# EasyEDA Pro project 四轴机械臂主控板.eprj

# Schematic Schematic1_6
Create Date: 2023-11-30; Page Name: 海豚机械臂主控板; Project Name: 海豚机械臂主控板; Schematic Name: Schematic1_6; Update Date: 2023-11-30; Company: 启能团队; Drawed: 郭俊杰; Page Size: A4; Reviewed: 郭俊杰; Version: V1.0
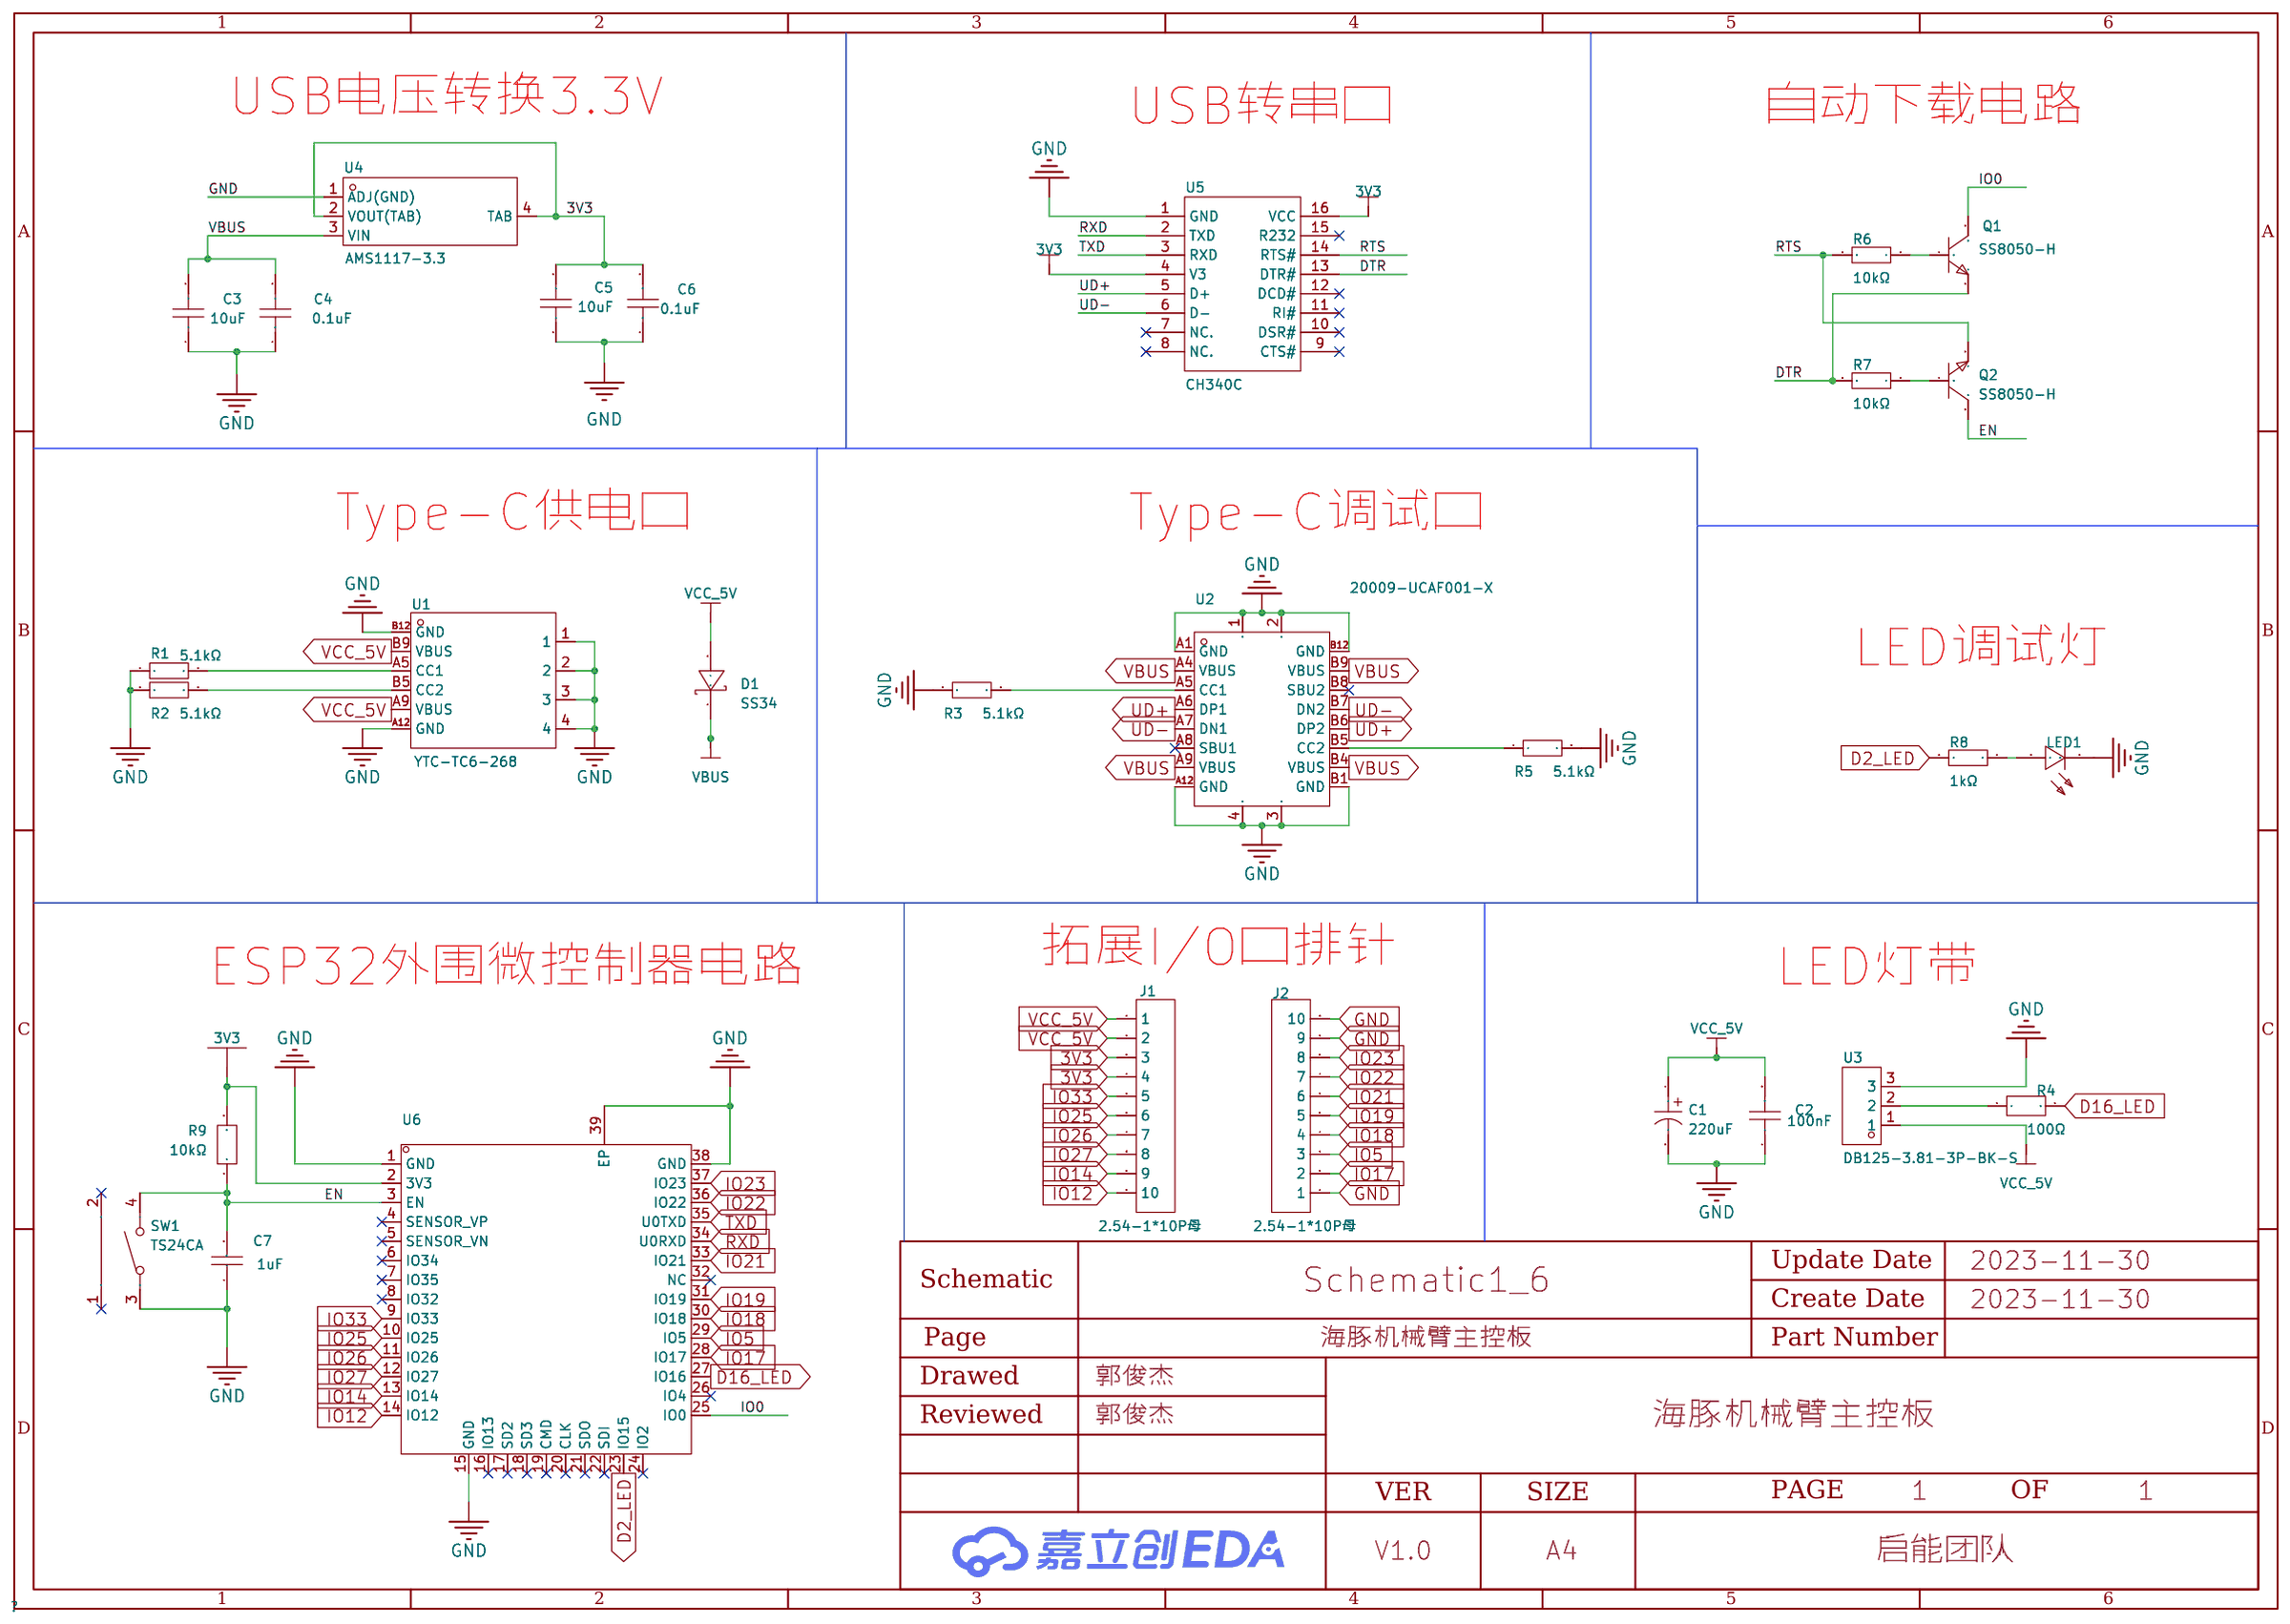
[diagram p0: schematic sheet]

## Parts
C1  220uF  [CAP-SMD_BD6.3-L6.6-W6.6-FD-2]
C2  100nF  [C0603]
C3  10uF  [c0603]
C4  0.1uF  [c0603]
C5  10uF  [c0603]
C6  0.1uF  [c0603]
C7  1uF  [C0603]
D1  SS34  [DO-214AC_L4.3-W2.7-LS5.3-RD]
J1  2.54-1*10P母  [HDR-TH_10P-P2.54-V-F]
J2  2.54-1*10P母  [HDR-TH_10P-P2.54-V-F]
LED1  19-217/GHC-YR1S2/3T  [LED0603-RD]
Q1  SS8050-H  [SOT-23-3_L2.9-W1.3-P1.90-LS2.4-BR]
Q2  SS8050-H  [SOT-23-3_L2.9-W1.3-P1.90-LS2.4-BR]
R1  5.1kΩ  [R0603]
R2  5.1kΩ  [R0603]
R3  5.1kΩ  [R0603]
R4  100Ω  [R0603]
R5  5.1kΩ  [R0603]
R6  10kΩ  [R0603]
R7  10kΩ  [R0603]
R8  1kΩ  [R0603]
R9  10kΩ  [r0603]
SW1  TS24CA  [SW-SMD_TS24CA]
U1  YTC-TC6-268  [TYPE-C-SMD_YIYUAN_YTC-TC6-268]
U2  20009-UCAF001-X  [TYPE-C-SMD_20009-UCAF001-X]
U3  DB125-3.81-3P-BK-S  [CONN-TH_DB125-3.81-3P-BK]
U4  AMS1117-3.3  [SOT-223-4_L6.5-W3.5-P2.30-LS7.0-BR]
U5  CH340C  [SOP-16_L10.0-W3.9-P1.27-LS6.0-BL]
U6  -  [wirelm-smd_esp32-s]

## Library data of the parts
C1 = RX220UF16V90RV0106: 容值:220uF;额定电压:16V;; LCSC Part Name: 220uF 16V; Supplier Part: C3445239; Manufacturer: KNSCHA(科尼盛); Supplier Footprint: SMD,D6.3xL5.7mm; JLCPCB Part Class: 扩展库; Datasheet: https://atta.szlcsc.com/upload/public/pdf/source/20220701/150B24AB0374BC4B00A0E4548A80C050.pdf; Supplier: LCSC; Rated Voltage: 16V
C2 = CL10B104KB8NNNC: 容值:100nF;精度:±10%;额定电压:50V;材质(温度系数):X7R;; LCSC Part Name: 100nF ±10% 50V; Supplier Part: C1591; Manufacturer: SAMSUNG(三星); Supplier Footprint: 0603; JLCPCB Part Class: 扩展库; Datasheet: https://atta.szlcsc.com/upload/public/pdf/source/20160103/1457707680512.pdf; Supplier: LCSC; Tolerance: ±10%; Voltage Rated: 50V; Temperature Coefficient: X7R
C3 = mt18n1r5c500ct: 容值:10uF;精度:±0.25pF;额定电压:50V;温度系数:NP0;; Supplier Part: C96446; Manufacturer: 华新科(Walsin); Manufacturer Part: MT18N1R5C500CT; Supplier Footprint: 0603; JLCPCB Part Class: Extended Part; Datasheet: https://atta.szlcsc.com/upload/public/pdf/source/20191217/C470045_C8EA1FED8E7D9FF06975A0CE3DEB0325.pdf; Supplier: LCSC; Tolerance: ±0.25pF; Voltage Rated: 50V; Temperature Coefficient: NP0
C4 C6 = mt18n1r5c500ct: 容值：100nF 精度：±10% 额定电压：50V 材质(温度系数)：X7R 材质:X7R; LCSC Part Name: 100nF; Supplier Part: C14663; Manufacturer: 华新科(Walsin); Manufacturer Part: MT18N1R5C500CT; Supplier Footprint: 0603; JLCPCB Part Class: Extended Part; Datasheet: https://atta.szlcsc.com/upload/public/pdf/source/20191217/C470045_C8EA1FED8E7D9FF06975A0CE3DEB0325.pdf; Supplier: LCSC; Tolerance: ±0.25pF; Voltage Rated: 50V; Temperature Coefficient: NP0
C5 = mt18n1r5c500ct: 容值:10uF;精度:±0.25pF;额定电压:50V;温度系数:NP0;; LCSC Part Name: 10uF 25V; Supplier Part: C96446; Manufacturer: 华新科(Walsin); Manufacturer Part: MT18N1R5C500CT; Supplier Footprint: 0603; JLCPCB Part Class: Extended Part; Datasheet: https://atta.szlcsc.com/upload/public/pdf/source/20191217/C470045_C8EA1FED8E7D9FF06975A0CE3DEB0325.pdf; Supplier: LCSC; Tolerance: ±0.25pF; Voltage Rated: 50V; Temperature Coefficient: NP0
C7 = CL10A105KB8NNNC: 容值:1uF;精度:±10%;额定电压:50V;材质(温度系数):X5R;; LCSC Part Name: 1uF ±10% 50V; Supplier Part: C15849; Manufacturer: SAMSUNG(三星); Supplier Footprint: 0603; JLCPCB Part Class: 基础库; Datasheet: https://atta.szlcsc.com/upload/public/pdf/source/20160103/1457707679084.pdf; Supplier: LCSC; Tolerance: ±10%; Voltage Rated: 50V; Temperature Coefficient: X5R
D1 = SS34_C8678: 二极管配置:独立式;直流反向耐压(Vr):40V;平均整流电流(Io):3A;正向压降(Vf):550mV@3A;反向电流(Ir):500uA@40V;; LCSC Part Name: 40V 3A 550mV@3A; Supplier Part: C8678; Manufacturer: MDD; Supplier Footprint: SMA(DO-214AC); JLCPCB Part Class: 基础库; Datasheet: https://atta.szlcsc.com/upload/public/pdf/source/20220408/D0396E57A6E83C6AFC0ED25EC9EDE030.pdf; Supplier: LCSC; Diode Configuration: 独立式; Reverse Voltage (Vr): 40V; Average Rectified Current (Io): 3A; Forward Voltage (Vf@If): 550mV@3A; Reverse Leakage Current (Ir): 500uA@40V
J1 J2 = 2.54-1*10P母: 排数:单排;总孔位数:10;间距:2.54mm;插孔结构:1x10P;行距:-;安装类型:直插;塑高:-;触头材质:-;触头镀层:-;; LCSC Part Name: 2.54mm 1x10P; Supplier Part: C35445; Manufacturer: BOOMELE(博穆精密); Supplier Footprint: 插件,P=2.54mm; JLCPCB Part Class: 扩展库; Datasheet: https://atta.szlcsc.com/upload/public/pdf/source/20200813/C35445_A4147CED0A1C9075722E373C7771E928.pdf; Supplier: LCSC; Number of Rows: 单排; Number of Holes: 10; Pitch: 2.54mm; Holes Structure: 1x10P; Mounting Type: 直插
LED1 = 19-217/GHC-YR1S2/3T: 发光颜色:翠绿;二极管配置:-;透镜颜色:无色透明;主波长:520nm~535nm;峰值波长:518nm;色温:-;测试电流:20mA;功率:110mW;发光角度:120°;安装方式:-;工作温度:-40~+85;; LCSC Part Name: 翠绿 520nm~535nm; Supplier Part: C72043; Manufacturer: EVERLIGHT(亿光); Supplier Footprint: 0603; JLCPCB Part Class: 基础库; Datasheet: https://atta.szlcsc.com/upload/public/pdf/source/20160507/1462613613780.pdf; Supplier: LCSC; Emitted Color: 翠绿; Lens Color: 无色透明; Dominant Wavelength: 520nm~535nm; Peak Wavelength: 518nm; Forward Current: 20mA; Power Dissipation: 110mW; Viewing Angle: 120°; Operating Temperature: -40~+85
Q1 Q2 = SS8050-H: 晶体管类型:NPN;集射极击穿电压(Vceo):25V;集电极电流(Ic):1.5A;功率(Pd):300mW;集电极截止电流(Icbo):100nA;集电极-发射极饱和电压(VCE(sat)@Ic,Ib):500mV@800mA,80mA;直流电流增益(hFE@Ic,Vce):200@100mA,1V;特征频率(fT):100MHz;工作温度:-55~+150@(Tj);; LCSC Part Name: NPN 25V 1.5A; Supplier Part: C699255; Manufacturer: YANGJIE(扬杰); Supplier Footprint: SOT-23-3L; JLCPCB Part Class: 扩展库; Datasheet: https://atta.szlcsc.com/upload/public/pdf/source/20200709/C699255_98BD284548BE18129453A2CE3A1F2C22.pdf; Supplier: LCSC; Transistor Type: NPN; Collector-Emitter Breakdown Voltage (Vceo): 25V; Collector Current (Ic): 1.5A; Power Dissipation (Pd): 300mW; Collector Cut-Off Current (Icbo): 100nA; Collector-Emitter Saturation Voltage (VCE(sat)@Ic,Ib): 500mV@800mA,80mA; DC Current Gain (hFE@Ic,Vce): 200@100mA,1V; Transition Frequency (fT): 100MHz; Operating Temperature: -55~+150@(Tj)
R1-R3 R5 = 0603WAF5101T5E: 电阻类型:厚膜电阻;阻值:5.1kΩ;精度:±1%;功率:100mW;温度系数:±100ppm/;最大工作电压:75V;工作温度范围:-55~+155;; LCSC Part Name: 5.1kΩ ±1% 100mW; Supplier Part: C23186; Manufacturer: UNI-ROYAL(厚声); Supplier Footprint: 0603; JLCPCB Part Class: 基础库; Datasheet: https://atta.szlcsc.com/upload/public/pdf/source/20200306/C422600_1E6D84923E4A46A82E41ADD87F860B5C.pdf; Supplier: LCSC; Type: 厚膜电阻; Tolerance: ±1%; Power(Watts): 100mW; Temperature Coefficient: ±100ppm/; Overload Voltage (Max): 75V; Operating Temperature Range: -55~+155
R4 = 0603 ±5% 100Ω: 电阻类型:厚膜电阻;阻值:100Ω;精度:±5%;功率:100mW;温度系数:±100ppm/;最大工作电压:75V;工作温度范围:-55~+155;; LCSC Part Name: 100Ω ±5% 100mW; Supplier Part: C2889393; Manufacturer: VO(翔胜); Supplier Footprint: 0603; JLCPCB Part Class: 扩展库; Datasheet: https://atta.szlcsc.com/upload/public/pdf/source/20210902/777BF6DFB3B29B13210374B07BC23D84.pdf; Supplier: LCSC; Type: 厚膜电阻; Tolerance: ±5%; Power(Watts): 100mW; Temperature Coefficient: ±100ppm/; Overload Voltage (Max): 75V; Operating Temperature Range: -55~+155
R6 R7 = ERJ3EKF1002V: 阻值:10kΩ;精度:±1%;功率:100mW;温度系数:±100ppm/;最大工作电压:-;工作温度范围:-55~+155;; LCSC Part Name: 10kΩ ±1%; Supplier Part: C191124; Manufacturer: PANASONIC(松下); Supplier Footprint: 0603; JLCPCB Part Class: 扩展库; Datasheet: https://atta.szlcsc.com/upload/public/pdf/source/20180502/C191124_A4CEFA964CCDF04BFD540D495CFFCAE0.pdf; Supplier: LCSC; Tolerance: ±1%; Power(Watts): 100mW; Temperature Coefficient: ±100ppm/; Operating Temperature Range: -55~+155
R8 = 0603WAF1001T5E: 电阻类型:厚膜电阻;阻值:1kΩ;精度:±1%;功率:100mW;温度系数:±100ppm/;最大工作电压:75V;工作温度范围:-55~+155;; LCSC Part Name: 1kΩ ±1% 100mW; Supplier Part: C21190; Manufacturer: UNI-ROYAL(厚声); Supplier Footprint: 0603; JLCPCB Part Class: 基础库; Datasheet: https://atta.szlcsc.com/upload/public/pdf/source/20200306/C422600_1E6D84923E4A46A82E41ADD87F860B5C.pdf; Supplier: LCSC; Type: 厚膜电阻; Tolerance: ±1%; Power(Watts): 100mW; Temperature Coefficient: ±100ppm/; Overload Voltage (Max): 75V; Operating Temperature Range: -55~+155
R9 = sg73p1jttd1002f: 阻值:10kΩ;精度:±1%;功率:-;温度系数:-;; LCSC Part Name: 10kΩ ±1%; Supplier Part: C880254; Manufacturer: KOA; Manufacturer Part: SG73P1JTTD1002F; Supplier Footprint: 0603; JLCPCB Part Class: Extended Part; Datasheet: https://atta.szlcsc.com/upload/public/pdf/source/20190109/C346159_A2BB9C83E7E727C8F8277542505B206B.pdf; Supplier: LCSC; Tolerance: ±1%
SW1 = TS24CA: 触点电流:50mA;额定电压(DC):12V;电路结构:单刀单掷;安装方式:卧贴;按钮形状:矩形按钮;带灯:-;开关长度:4.55mm;开关宽度:1.8mm;开关高度:3.5mm;; LCSC Part Name: 2*4*3.5半包小贝贝TS-018小侧按键m165蓝牙耳机轻触开关; Supplier Part: C393942; Manufacturer: SHOU HAN(首韩); Supplier Footprint: SMD; JLCPCB Part Class: 扩展库; Datasheet: https://atta.szlcsc.com/upload/public/pdf/source/20190521/C393942_591A9E318887EFA4274D34029981AD99.pdf; Supplier: LCSC; Contact Current: 50mA; Voltage Rating (DC): 12V; Circuit: 单刀单掷; Mounting Style: 卧贴; Actuator Style: 矩形按钮; Switch Length: 4.55mm; Switch Width: 1.8mm; Switch Height: 3.5mm
U1 = YTC-TC6-268: 连接器类型:Type-C;公母:母座;触点数量:6;; LCSC Part Name: Type-C 母座; Supplier Part: C5260484; Manufacturer: YIYUAN(怡远); Supplier Footprint: SMD; JLCPCB Part Class: 扩展库; Datasheet: https://atta.szlcsc.com/upload/public/pdf/source/20221115/94102468E8C367463F1D717839C68408.pdf; Supplier: LCSC; Connector Type: Type-C; Gender: 母座; Number of Contacts: 6
U2 = 20009-UCAF001-X: LCSC Part Name: TYPE C; Supplier Part: C3148200; Manufacturer: MINTRON(明硕); Supplier Footprint: SMD; JLCPCB Part Class: 扩展库; Datasheet: https://atta.szlcsc.com/upload/public/pdf/source/20220705/4C04992B6F70FB490BC74B4779796E6C.pdf; Supplier: LCSC
U3 = DB125-3.81-3P-BK-S: 间距:3.81mm;排数:1;每排PIN数:3;安装方式:直针;额定电流:10A;额定电压:300V;线规 - AWG:16~26;线规 - mm?:0.5~1;工作温度范围:-40~+105;颜色:黑色;; LCSC Part Name: 3.81mm 排数:1 每排P数:3 直针; Supplier Part: C881704; Manufacturer: DIBO(地博电气); Supplier Footprint: 直插,P=3.81mm; JLCPCB Part Class: 扩展库; Datasheet: https://atta.szlcsc.com/upload/public/pdf/source/20210728/C2858301_9913CD4664B5BAF8F216E1FE7B518C99.pdf; Supplier: LCSC; Pitch: 3.81mm; Number of Rows: 1; Number of PINs Per Row: 3; Mounting Style: 直针; Current Rating (Max): 10A; Voltage Rating (Max): 300V; Wire Gauge - AWG: 16~26; Wire Gauge - mm?: 0.5~1; Operating Temperature Range: -40~+105; Color: 黑色
U4 = AMS1117-3.3_C347222: 输出类型:固定;输出极性:正;输出通道数:1;最大输入电压:18V;输出电压:3.3V;压差:1.3V@(1A);输出电流:1A;电源纹波抑制比(PSRR):60dB@(120Hz);; LCSC Part Name: 正 Vin=18V Vout=3.3V 1A 60dB@(120Hz); Supplier Part: C347222; Manufacturer: UMW(广东友台半导体); Supplier Footprint: SOT-223-4; JLCPCB Part Class: 扩展库; Datasheet: https://atta.szlcsc.com/upload/public/pdf/source/20211011/50CC665C22E3A66C08379A4A74BDA25C.pdf; Supplier: LCSC; Output Type: 固定; Output Polarity: 正; Number of Outputs: 1; Maximum Input Voltage: 18V; Output Voltage: 3.3V; Dropout Voltage: 1.3V@(1A); Output Current: 1A; Power Supply Rejection Ratio (PSRR): 60dB@(120Hz)
U5 = CH340C: 类型:Transceiver;协议类别:USB 2.0;驱动器/接收器数:-;数据速率:2Mbps;; Supplier Part: C84681; Manufacturer: WCH(南京沁恒); Supplier Footprint: SOP-16_150mil; JLCPCB Part Class: 扩展库; Datasheet: https://atta.szlcsc.com/upload/public/pdf/source/20200819/C84681_ADBED554CE321879DBD6B1D06488689C.pdf; Supplier: LCSC; Type: Transceiver; Protocol: USB 2.0; Data Rate: 2Mbps; Supply Voltage: 3.3V, 5V
U6 = esp32-s: LCSC Part Name: ESP32-S; Supplier Part: C277944; Manufacturer: Ai-Thinker(安信可); Manufacturer Part: ESP32-S; Supplier Footprint: SMD Module; JLCPCB Part Class: Extended Part; Datasheet: https://atta.szlcsc.com/upload/public/pdf/source/20211217/F4BEA33E732D6002D10DAED85BBCB52B.pdf; Supplier: LCSC

## Nets
3V3: C5.2 C6.2 J1.3 J1.4 R9.2 U4.2(VOUT(TAB)) U4.4(TAB) U5.4(V3) U5.16(VCC) U6.2(3V3)
GND: C1.2 C2.1 C3.1 C4.1 C5.1 C6.1 C7.1 J2.1 J2.9 J2.10 LED1.1(C) R1.1 R2.1 R3.1 R5.2 SW1.3 U1.1 U1.2 U1.3 U1.4 U1.A12(GND) U1.B12(GND) U2.1 U2.2 U2.3 U2.4 U2.A1(GND) U2.A12(GND) U2.B1(GND) U2.B12(GND) U3.3 U4.1(ADJ(GND)) U5.1(GND) U6.1(GND) U6.15(GND) U6.38(GND) U6.39(EP)
VBUS: C3.2 C4.2 D1.1(K) U2.A4(VBUS) U2.A9(VBUS) U2.B4(VBUS) U2.B9(VBUS) U4.3(VIN)
VCC_5V: C1.1 C2.2 D1.2(A) J1.1 J1.2 U1.A9(VBUS) U1.B9(VBUS) U3.1
D2_LED: R8.2 U6.23(IO15)
D16_LED: R4.2 U6.27(IO16)
DTR: Q1.2(E) R7.2 U5.13(DTR#)
EN: C7.2 Q2.3(C) R9.1 SW1.4 U6.3(EN)
IO0: Q1.3(C) U6.25(IO0)
IO5: J2.3 U6.29(IO5)
IO12: J1.10 U6.14(IO12)
IO14: J1.9 U6.13(IO14)
IO17: J2.2 U6.28(IO17)
IO18: J2.4 U6.30(IO18)
IO19: J2.5 U6.31(IO19)
IO21: J2.6 U6.33(IO21)
IO22: J2.7 U6.36(IO22)
IO23: J2.8 U6.37(IO23)
IO25: J1.6 U6.10(IO25)
IO26: J1.7 U6.11(IO26)
IO27: J1.8 U6.12(IO27)
IO33: J1.5 U6.9(IO33)
RTS: Q2.2(E) R6.2 U5.14(RTS#)
RXD: U5.2(TXD) U6.34(U0RXD)
TXD: U5.3(RXD) U6.35(U0TXD)
UD+: U2.A6(DP1) U2.B6(DP2) U5.5(D+)
UD-: U2.A7(DN1) U2.B7(DN2) U5.6(D-)
$1N8069: Q1.1(B) R6.1
$1N8071: Q2.1(B) R7.1
$1N24567: LED1.2(A) R8.1
$1N27163: R4.1 U3.2
$1N30891: R1.2 U1.A5(CC1)
$1N30924: R2.2 U1.B5(CC2)
$1N35589: R3.2 U2.A5(CC1)
$1N35650: R5.1 U2.B5(CC2)

Not connected (* = marked no-connect by the designer): SW1 1* 2*; U2 A8(SBU1)* B8(SBU2)*; U5 7(NC.)* 8(NC.)* 9(CTS#)* 10(DSR#)* 11(RI#)* 12(DCD#)* 15(R232)*; U6 4(SENSOR_VP)* 5(SENSOR_VN)* 6(IO34)* 7(IO35)* 8(IO32)* 16(IO13)* 17(SD2)* 18(SD3)* 19(CMD)* 20(CLK)* 21(SDO)* 22(SDI)* 24(IO2)* 26(IO4)* 32(NC)*

## Notes on the sheet
- USB电压转换3.3V
- USB转串口
- 自动下载电路
- Type-C供电口
- Type-C调试口
- LED调试灯
- 拓展I/O口排针
- ESP32外围微控制器电路
- LED灯带

# Board 海豚机械臂主控板
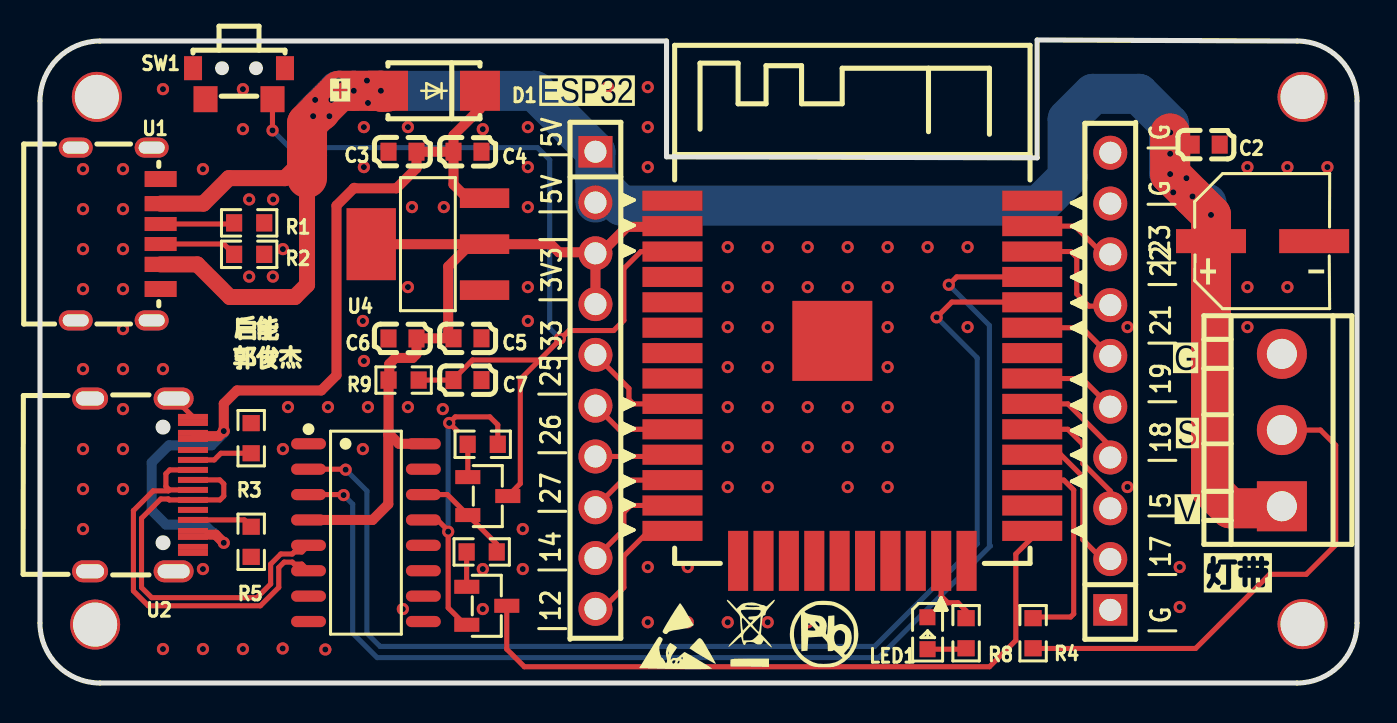
[diagram p1: board, top side]
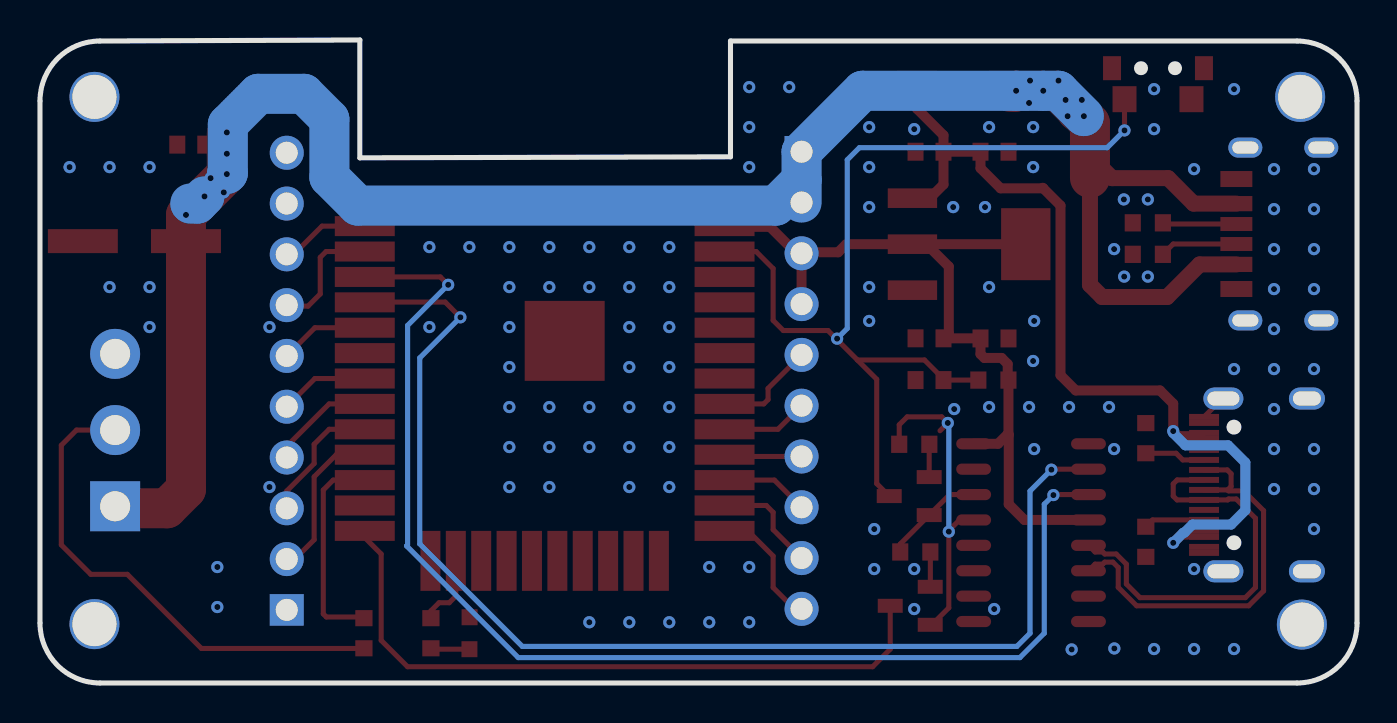
[diagram p2: board, bottom side, seen from below]

Outline 65.89 x 32.16 mm; copper layers: Top Layer, Bottom Layer. Coordinates in mm from the lower left corner of the outline.
Outline path: 0,29.11 0,3 arc(0.88,0.88) 3,0 62.89,0 arc(65.01,0.88) 65.89,3 65.89,29.11 arc(65.01,31.23) 62.89,32.11 49.89,32.16 49.89,26.26 31.34,26.31 31.34,32.11 3,32.11 arc(0.88,31.23) 0,29.11
Stack: Top Layer 0.035mm / Dielectric1 1.51mm FR4 er 4.5 / Bottom Layer 0.035mm

## Design rules (mm)
net UD-: DP1
net UD+: DP1
spacing safeClearance (default): track to track 0.152, other pairs 0.145 to 0.3
track width trackWidth (default): min 0.127, default 0.254, max 2.54
differential pair differentialPair (default): width min 0.127, default 0.254, max 2.54; gap min 0.152, default 0.152
via viaSize (default): diameter min 0.5, default 0.61, max 10; hole min 0.3, default 0.305, max 6

## Placement (name value [footprint] x y rotation side)
C1  220uF  [CAP-SMD_BD6.3-L6.6-W6.6-FD-2]  61.16 22.1 0 top
C2  100nF  [C0603]  58.32 26.92 180 top
C3  10uF  [c0603]  18.14 26.57 0 top
C4  0.1uF  [c0603]  21.39 26.57 180 top
C5  10uF  [c0603]  21.39 17.24 180 top
C6  0.1uF  [c0603]  18.14 17.23 0 top
C7  1uF  [C0603]  21.39 15.15 180 top
D1  SS34  [DO-214AC_L4.3-W2.7-LS5.3-RD]  19.71 29.62 180 top
J1  2.54-1*10P母  [HDR-TH_10P-P2.54-V-F]  27.79 15.14 270 top
J2  2.54-1*10P母  [HDR-TH_10P-P2.54-V-F]  53.54 15.09 90 top
LED1  19-217/GHC-YR1S2/3T  [LED0603-RD]  44.4 2.49 270 top
NOREF  -  [Pad_e311]  2.84 29.31 0 top
NOREF#2  -  [Pad_e318]  2.76 2.92 0 top
NOREF#3  -  [Pad_e322]  63.16 29.31 0 top
NOREF#4  -  [Pad_e325]  63.16 2.94 0 top
Q1  SS8050-H  [SOT-23-3_L2.9-W1.3-P1.90-LS2.4-BR]  22.35 3.86 180 top
Q2  SS8050-H  [SOT-23-3_L2.9-W1.3-P1.90-LS2.4-BR]  22.4 9.35 180 top
R1  5.1kΩ  [R0603]  10.47 23.01 180 top
R2  5.1kΩ  [R0603]  10.47 21.44 180 top
R3  5.1kΩ  [R0603]  10.57 12.24 270 top
R4  100Ω  [R0603]  49.68 2.49 90 top
R5  5.1kΩ  [R0603]  10.57 7.06 270 top
R6  10kΩ  [R0603]  22.1 6.55 0 top
R7  10kΩ  [R0603]  22.15 11.94 0 top
R8  1kΩ  [R0603]  46.33 2.49 90 top
R9  10kΩ  [r0603]  18.19 15.15 180 top
SW1  TS24CA  [SW-SMD_TS24CA]  9.96 29.97 0 top
U1  YTC-TC6-268  [TYPE-C-SMD_YIYUAN_YTC-TC6-268]  3.91 22.45 270 top
U2  20009-UCAF001-X  [TYPE-C-SMD_20009-UCAF001-X]  5.08 9.91 270 top
U3  DB125-3.81-3P-BK-S  [CONN-TH_DB125-3.81-3P-BK]  62.13 12.65 90 top
U4  AMS1117-3.3  [SOT-223-4_L6.5-W3.5-P2.30-LS7.0-BR]  19.41 21.95 0 top
U5  CH340C  [SOP-16_L10.0-W3.9-P1.27-LS6.0-BL]  16.31 7.52 270 top
U6  -  [wirelm-smd_esp32-s]  40.64 15.11 0 top

## Footprints (pads in the part's own frame, mm; a bottom-side part is the same pattern mirrored in y, then rotated)
C0603
  rect 0.8x0.9 smd: 1(-0.7,0) 2(0.7,0)
c0603
  rect 0.8x0.9 smd: 1(-0.7,0) 2(0.7,0)
CAP-SMD_BD6.3-L6.6-W6.6-FD-2
  rect 3.5x1.2 smd: 1(-2.58,0) 2(2.58,0)
CONN-TH_DB125-3.81-3P-BK
  rect 2.5x2.5 hole 1.5: 1(-3.81,0)
  round 2.5 hole 1.5: 2(0,0) 3(3.81,0)
DO-214AC_L4.3-W2.7-LS5.3-RD
  rect 2x2 smd: 1(-2.3,0) 2(2.3,0)
HDR-TH_10P-P2.54-V-F
  rect 1.575x1.7 hole 1.1: 1(-11.43,0)
  round 1.7 hole 1.1: 2(-8.89,0) 3(-6.35,0) 4(-3.81,0) 5(-1.27,0) 6(1.27,0) 7(3.81,0) 8(6.35,0) 9(8.89,0) 10(11.43,0)
LED0603-RD
  rect 0.8x0.8 smd: 1(-0.799,-0.004) 2(0.799,0.004)
Pad_e311
  round 2.5 hole 2.2: 18(0,0)
Pad_e318
  round 2.5 hole 2.2: 21(0,0)
Pad_e322
  round 2.5 hole 2.2: 22(0,0)
Pad_e325
  round 2.5 hole 2.2: 27(0,0)
R0603
  rect 0.806x0.864 smd: 1(-0.753,0) 2(0.753,0)
r0603
  rect 0.806x0.864 smd: 1(-0.753,0) 2(0.753,0)
SOP-16_L10.0-W3.9-P1.27-LS6.0-BL
  oval 0.56x1.745 smd: 1(-4.445,-2.873) 2(-3.175,-2.873) 3(-1.905,-2.873) 4(-0.635,-2.873) 5(0.635,-2.873) 6(1.905,-2.873) 7(3.175,-2.873) 8(4.445,-2.873) 9(4.445,2.873) 10(3.175,2.873) 11(1.905,2.873) 12(0.635,2.873) 13(-0.635,2.873) 14(-1.905,2.873) 15(-3.175,2.873) 16(-4.445,2.873)
SOT-23-3_L2.9-W1.3-P1.90-LS2.4-BR
  rect 1.25x0.7 smd: 1(1,-0.95) 2(1,0.95) 3(-1,0)
SOT-223-4_L6.5-W3.5-P2.30-LS7.0-BR
  rect 2.47x0.98 smd: 1(2.835,-2.3) 2(2.835,0) 3(2.835,2.3)
  rect 2.47x3.6 smd: 4(-2.835,0)
SW-SMD_TS24CA
  rect 0.9x1.2 smd: 1(-2.3,0.775) 2(2.3,0.775)
  rect 1.2x1.3 smd: 3(-1.675,-0.775) 4(1.675,-0.775)
TYPE-C-SMD_20009-UCAF001-X
  oval 1.1x2 hole 0.7x1.6: 1(-4.32,1.606) 2(4.32,1.606)
  oval 1.1x1.8 hole 0.7x1.4: 3(4.32,-2.574) 4(-4.32,-2.574)
  rect 0.3x1.5 smd: A1(-3.4,2.573) A4(-2.6,2.573) A5(-1.25,2.573) A6(-0.25,2.573) A7(0.25,2.573) A8(1.25,2.574) A9(2.6,2.574) A12(3.4,2.573) B1(3.1,2.573) B4(2.3,2.574) B5(1.75,2.573) B6(0.75,2.573) B7(-0.75,2.573) B8(-1.75,2.574) B9(-2.3,2.573) B12(-3.1,2.573)
TYPE-C-SMD_YIYUAN_YTC-TC6-268
  oval 1x1.7 hole 0.6x1.3: 1(-4.32,1.675) 2(4.32,1.675) 3(4.32,-2.124) 4(-4.32,-2.124)
  rect 0.7x1.6 smd: A5(-0.5,2.124) B5(0.5,2.124)
  rect 0.76x1.6 smd: A9(1.52,2.124) B9(-1.52,2.124)
  rect 0.8x1.6 smd: A12(2.75,2.124) B12(-2.75,2.124)
wirelm-smd_esp32-s
  rect 2.999x1.001 smd: 1(-8.999,9.005) 2(-8.999,7.734) 3(-8.999,6.465) 4(-8.999,5.194) 5(-8.999,3.925) 6(-8.999,2.655) 7(-8.999,1.385) 8(-8.999,0.115) 9(-8.999,-1.155) 10(-8.999,-2.425) 11(-8.999,-3.696) 12(-8.999,-4.965) 13(-8.999,-6.236) 14(-8.999,-7.505) 25(8.999,-7.505) 26(8.999,-6.236) 27(8.999,-4.965) 28(8.999,-3.696) 29(8.999,-2.425) 30(8.999,-1.155) 31(8.999,0.115) 32(8.999,1.385) 33(8.999,2.655) 34(8.999,3.925) 35(8.999,5.194) 36(8.999,6.465) 37(8.999,7.734) 38(8.999,9.005)
  rect 1.001x2.999 smd: 15(-5.715,-9.005) 16(-4.445,-9.005) 17(-3.175,-9.005) 18(-1.905,-9.005) 19(-0.635,-9.005) 20(0.635,-9.005) 21(1.905,-9.005) 22(3.175,-9.005) 23(4.445,-9.005) 24(5.715,-9.005)
  rect 4x4 smd: 39(-1.001,1.996)

## Nets
As in the schematic.

Pads without a net: NOREF 18; NOREF#2 21; NOREF#3 22; NOREF#4 27; SW1 1 2; U2 A8 B8; U5 7 8 9 10 11 12 15; U6 4 5 6 7 8 16 17 18 19 20 21 22 24 26 32

## Via types
v1: diameter 0.61, hole 0.304, Top Layer to Bottom Layer, 109 vias
v2: diameter 0.61, hole 0.305, Top Layer to Bottom Layer, 30 vias

## Routing (per net, layer and track width the routed paths; a pad name or vN(x,y) marks a point on that pad's centre or on a via; arc(x,y) is an arc through that point)
3V3: length 41.2
  Top Layer w0.5: J1.3 27.74,21.54 25.96,21.54 25.55,21.95 21.54,21.95 ; J1.3 28.04,21.49 29.36,22.81 31.6,22.81 U6.2 ; J1.3 J1.4 ; 21.54,21.95 16.5,21.95 ; 21.54,21.95 20.42,20.83 20.42,17.5 C5.2 18.84,17.24 C6.2 18.84,16.45 18.64,16.26 17.78,16.26 17.48,15.95 17.48,15.19 R9.2 17.44,12.48 17.48,12.45 ; 17.48,12.45 17.42,12.4 17.42,8.94 16.64,8.15 U5.4 ; 17.48,12.45 17.96,11.96 U5.16
GND: length 1.3
  Top Layer w0.254: U2.A1 6.73,14.23 U2.1
  vias: v1(2.15,25.7) v1(2.15,23.7) v1(2.15,21.7) v1(2.15,19.7) v1(2.15,15.7) v1(2.15,11.7) v1(2.15,9.7) v1(2.15,7.7) v1(4.15,25.7) v1(4.15,23.7) v1(4.15,21.7) v1(4.15,19.7) v1(4.15,17.7) v1(4.15,15.7) v1(4.15,13.7) v1(4.15,11.7) v1(4.15,9.7) v1(6.15,29.7) v1(6.15,15.7) v1(6.15,1.7) v1(8.15,25.7) v1(8.15,5.7) v1(8.15,1.7) v1(10.15,29.7) v1(10.15,27.7) v1(10.15,1.7) v1(12.15,21.7) v1(12.15,11.7) v1(12.14,1.73) v1(12.41,13.8) v1(14.28,1.68) v1(14.41,13.8) v1(16.15,18.11) v1(16.15,11.7) v1(16.2,27.8) v1(16.2,25.8) v1(16.21,16.1) v1(16.41,13.8) v1(18.15,3.7) v1(18.41,27.8) v1(18.41,19.8) v1(18.41,13.8) v1(18.61,23.8) v1(20.15,13.7) v1(20.2,23.8) v1(22.15,27.7) v1(22.15,5.7) v1(22.15,3.7) v1(24.15,7.7) v1(24.15,5.7) v1(24.41,27.8) v1(24.41,25.8) v1(24.41,23.8) v1(24.41,19.8) v1(24.41,18.11) v1(28.41,29.8) v1(30.41,29.8) v1(30.41,27.8) v1(30.41,25.8) v1(30.41,5.8) v1(30.41,3.04) v1(32.41,5.8) v1(32.41,3.04) v1(34.41,21.8) v1(34.41,19.8) v1(34.41,17.8) v1(34.41,15.8) v1(34.41,13.8) v1(34.41,11.8) v1(34.41,9.8) v1(34.41,3.04) v1(36.41,21.8) v1(36.41,19.8) v1(36.41,17.8) v1(36.41,15.8) v1(36.41,13.8) v1(36.41,11.8) v1(36.41,9.8) v1(36.41,3.04) v1(38.41,21.8) v1(38.41,19.8) v1(38.41,13.8) v1(38.41,11.8) v1(38.41,3.04) v1(40.41,21.8) v1(40.41,19.8) v1(40.41,13.8) v1(40.41,11.8) v1(40.41,9.8) v1(42.41,21.8) v1(42.41,19.8) v1(42.41,17.8) v1(42.41,15.8) v1(42.41,13.8) v1(42.41,11.8) v1(42.41,9.8) v1(44.41,21.8) v1(46.41,21.8) v1(46.41,17.8) v1(54.41,17.8) v1(54.41,9.8) v1(57.02,5.8) v1(57.02,3.8) v1(60.41,25.8) v1(60.41,19.8) v1(60.41,17.8) v1(62.41,25.8) v1(62.41,19.8) v1(64.41,25.8) v2(10.47,24.18) v2(10.47,20.32) v2(11.66,24.18) v2(11.65,20.32)
VBUS: length 44
  Top Layer w0.5: C4.2 20.69,27.39 22.01,28.72 D1.1 ; C4.2 C3.2 18.84,25.74 17.83,24.74 15.7,24.74 ; C4.2 20.69,24.93 21.37,24.25 22.21,24.25 ; 15.7,24.74 14.83,23.88 14.83,15.39 14.07,14.63 9.86,14.63 9.19,13.97 v2(9.19,12.6) 8.94,12.34 7.81,12.34 ; 15.7,24.74 15.72,24.77 ; v2(9.19,7.01) 8.79,7.42 8.49,7.42
  Bottom Layer w0.5: v2(9.19,12.6) 9.19,12.5 8.59,11.89 6.45,11.89 5.59,11.02 5.59,8.64 6.3,7.92 8.23,7.92 8.64,7.52 8.69,7.52 v2(9.19,7.01)
VCC_5V: length 107.7
  Top Layer w0.8: 13.36,25.26 13.36,19.91 12.75,19.3 9.5,19.3 7.87,20.93 U1.A9 ; 6.04,23.97 8.17,23.97 9.45,25.25 12.25,25.25 13.36,26.36
  Top Layer w2: U3.1 62.03,8.74 59.54,8.74 58.58,9.69 C1.1 v2(58.58,23.41) v2(57.66,24.33) v2(56.54,25.45) v2(56.54,26.47) 56.54,27.48 ; 14.02,28.65 13.36,27.99 13.36,25.26 ; 14.02,28.65 14.02,28.6 ; 14.02,28.65 14.99,29.62 v2(15.7,29.62) v2(17.06,29.62) 17.11,29.57 17.36,29.57
  Bottom Layer w2: 27.79,25.16 J1.1 24.74,29.62 v2(17.06,29.62) v2(15.7,29.62) 14.94,29.62 v2(13.67,28.35) ; 27.79,25.16 29.07,23.88 49.99,23.88 51.41,25.3 51.41,28.19 52.68,29.46 54.97,29.46 56.49,27.94 56.49,25.5 v2(56.54,25.45) ; 27.79,25.16 J1.2 ; 58.37,23.98 58.01,23.98 v2(57.66,24.33)
  vias: v2(13.77,29.16) v2(14.48,28.35) v2(14.58,29.16) v2(14.94,30.12) v2(16.36,30.12) v2(16.41,29.01) v2(56.54,27.53) v2(56.69,24.54) v2(57.35,25.25)
D2_LED: length 3.7
  Top Layer w0.254: R8.2 46.33,3.61 45.92,4.01 45.42,4.01 45.09,4.34 U6.23
D16_LED: length 10.2
  Top Layer w0.254: U6.27 51.22,10.15 51.71,9.65 51.71,3.45 51.56,3.3 50.05,3.3
DTR: length 16.3
  Top Layer w0.254: Q1.2 21.27,2.91 20.42,3.76 20.42,7.62 19.89,8.15 U5.13 ; 20.86,12.62 v2(20.47,13) 20.78,13.31 22.5,13.31 22.9,12.91 R7.2
  Bottom Layer w0.254: v2(20.47,13) 20.42,12.95 v2(20.42,7.57)
EN: length 49.6
  Top Layer w0.254: 26.05,17.21 26.02,17.21 v2(26.01,17.22) ; 26.05,17.21 24.99,16.15 ; 26.05,17.21 26.47,17.63 28.7,17.63 29.21,18.14 29.21,20.73 30.06,21.58 U6.3 ; 24.99,16.15 21.64,16.15 20.69,15.2 C7.2 R9.1 ; 24.99,16.15 24.03,15.19 24.03,9.97 Q2.3 ; SW1.4 11.63,27.64
  Bottom Layer w0.254: v2(26.01,17.22) 25.5,17.73 25.5,26.16 24.89,26.77 12.5,26.77 v2(11.63,27.64)
IO0: length 34.4
  Top Layer w0.254: U6.25 49.64,7.27 48.82,6.45 48.82,2.13 47.5,0.81 24.23,0.81 23.35,1.69 Q1.3
IO5: length 6.6
  Top Layer w0.254: U6.29 51.42,12.69 52.17,11.94 52.17,10.97 53.54,9.6 J2.3
IO12: length 6.4
  Top Layer w0.254: U6.14 30.47,7.61 29.21,6.35 29.21,4.78 28.14,3.71 J1.10
IO14: length 5.4
  Top Layer w0.254: J1.9 29.21,7.67 29.21,8.53 29.55,8.88 U6.13
IO17: length 7.9
  Top Layer w0.254: J2.2 53.14,6.2 52.17,7.16 52.17,10.31 51.07,11.42 U6.28
IO18: length 5.3
  Top Layer w0.254: U6.30 51.42,13.96 53.54,11.84 J2.4
IO19: length 4.5
  Top Layer w0.254: 49.64,15.23 52.13,15.23 J2.5
IO21: length 4.5
  Top Layer w0.254: U6.33 52.13,17.77 53.54,16.36
IO22: length 6.1
  Top Layer w0.254: U6.36 51.57,21.58 51.87,21.29 51.87,19.46 52.48,18.85 53.49,18.85 J2.7
IO23: length 4.5
  Top Layer w0.254: 53.54,21.44 53.19,21.44 51.78,22.85 U6.37
IO25: length 4.3
  Top Layer w0.254: U6.10 28.97,12.69 J1.6
IO26: length 3.9
  Top Layer w0.254: U6.11 31.55,11.33 J1.7
IO27: length 4.4
  Top Layer w0.254: U6.12 29.15,10.15 J1.8
IO33: length 5.2
  Top Layer w0.254: J1.5 29.46,14.73 29.46,14.17 29.68,13.96 U6.9
RTS: length 5.1
  Top Layer w0.254: R6.2 22.85,6.95 Q2.2 20.38,9.42 U5.14
RXD: length 60.7
  Top Layer w0.254: 13.43,10.69 15.27,10.69 v2(15.29,10.67) ; U6.34 49.63,19.05 45.62,19.05 v2(44.86,18.29)
  Bottom Layer w0.254: v2(44.86,18.29) 46.89,16.26 46.89,6.96 41.76,1.83 17.02,1.83 16.36,2.49 16.36,9.6 v2(15.29,10.67)
TXD: length 61.8
  Top Layer w0.254: U5.3 15.16,9.42 v2(15.19,9.4) ; 49.64,20.31 45.86,20.31 v2(45.47,19.91)
  Bottom Layer w0.254: v2(15.19,9.4) 15.65,8.94 15.65,2.49 16.87,1.27 41.96,1.27 47.55,6.86 47.5,6.91 47.5,17.88 v2(45.47,19.91)
UD+: length 20.5
  Top Layer w0.254: U2.A6 9,10.16 9.19,9.96 9.19,9.35 9,9.16 U2.B6 6.47,9.16 6.42,9.2 6.04,9.2 5.08,8.24 5.08,4.78 5.59,4.27 10.86,4.27 11.54,4.95 11.54,5.94 12.05,6.45 12.62,6.45 12.72,6.55 13.1,6.55 U5.5
UD-: length 20.5
  Top Layer w0.254: 6.47,9.66 U2.A7 ; 6.47,9.66 6.42,9.61 5.66,9.61 4.67,8.62 4.67,4.61 5.42,3.86 11.02,3.86 11.95,4.78 11.95,5.78 12.22,6.05 12.62,6.05 12.72,5.94 13.1,5.94 13.43,5.61 ; 6.47,9.66 6.3,9.83 6.3,10.46 6.49,10.66 U2.B7
$1N8069: length 1.7
  Top Layer w0.254: R6.1 21.34,4.82 Q1.1
$1N8071: length 1.6
  Top Layer w0.254: Q2.1 21.4,11.93 R7.1
$1N24567: length 1.9
  Top Layer w0.254: LED1.2 46.28,1.69 R8.1
$1N27163: length 25
  Top Layer w0.254: U3.2 64.06,12.65 64.82,11.89 64.82,6.91 63.35,5.44 61.52,5.44 57.81,1.73 49.98,1.73
$1N30891: length 3.7
  Top Layer w0.254: U1.A5 9.65,22.95 R1.2
$1N30924: length 3.9
  Top Layer w0.254: U1.B5 9.2,21.95 R2.2
$1N35589: length 3.1
  Top Layer w0.254: R3.2 9.05,11.49 8.72,11.16 U2.A5
$1N35650: length 3.1
  Top Layer w0.254: U2.B5 10.22,8.16 R5.1

## Copper pours and planes (outline as drawn; the poured copper is in the pictures)
GND on Top Layer: -0.1,32.36 65.84,32.36 65.84,-0.15 -0.1,-0.15
GND on Bottom Layer: -0.1,32.51 66.04,32.51 66.04,-0.05 -0.1,-0.05

## Text on the board
Top Silkscreen Layer: |12 |14 |27 |26 |25 | |33 |3V3| |5V |5V | |23 |G  |G | |G  |17 |5  |18 |19 |21 |22 | + | ESP32 | G | S | V | 灯带 | 启能 / 郭俊杰 | ▲
